# EAGLE schematic cap_touch_input (EAGLE 5.06)
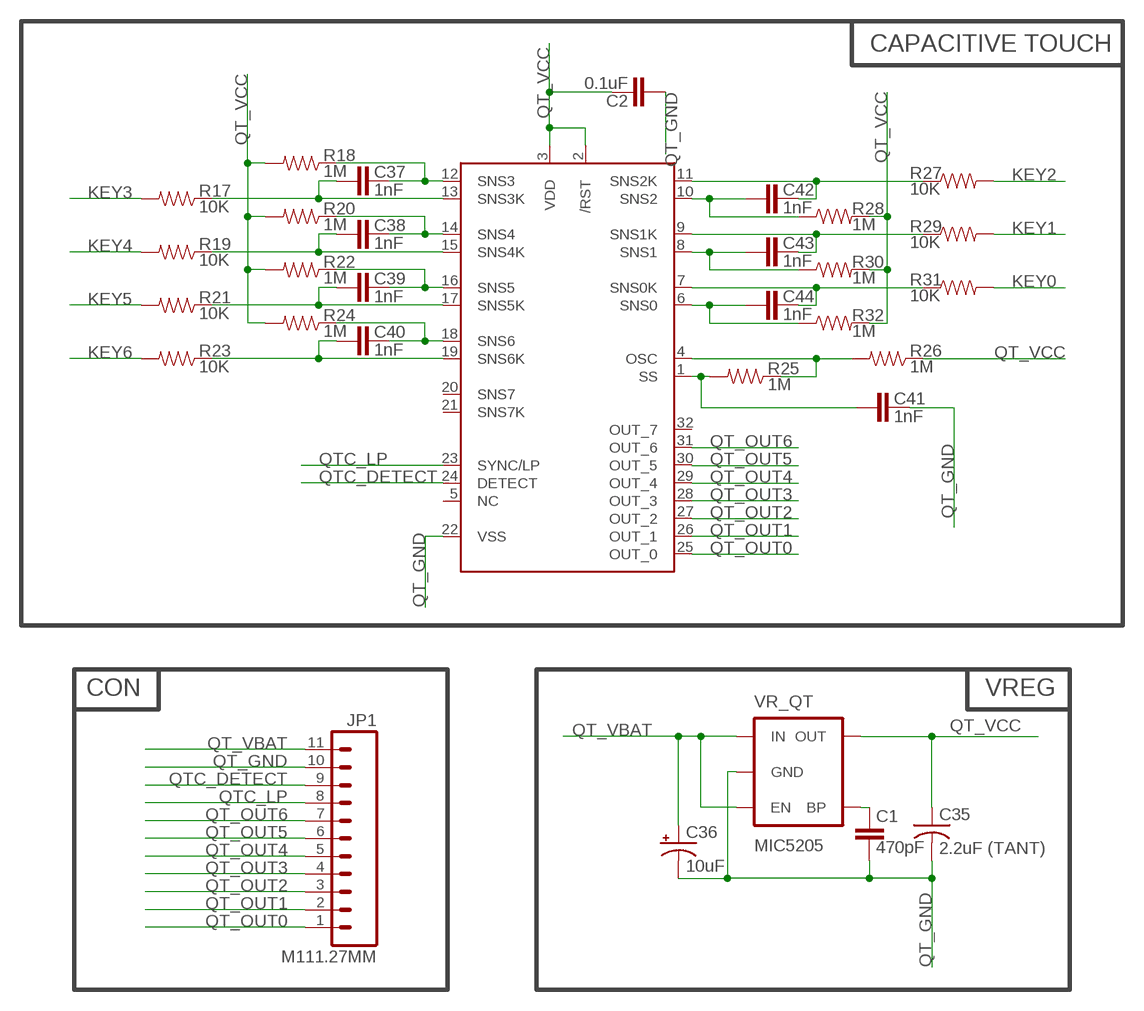
[diagram p0: schematic, sheet 1]

## Parts
C1  470pF  CAP0402  [C0402]
C2  0.1uF  CAP0402  [C0402]
C35  2.2uF (TANT)  C-USC0603K  [C0603K]
C36  10uF  CAP_POL1206  [EIA3216]
C37  1nF  CAP0402  [C0402]
C38  1nF  CAP0402  [C0402]
C39  1nF  CAP0402  [C0402]
C40  1nF  CAP0402  [C0402]
C41  1nF  CAP0402  [C0402]
C42  1nF  CAP0402  [C0402]
C43  1nF  CAP0402  [C0402]
C44  1nF  CAP0402  [C0402]
IC1  QT1081  [QFN-32]
JP1  M111.27MM  [1X11-1.27MM]
R17  10K  RESISTOR0402  [C0402]
R18  1M  RESISTOR0402  [C0402]
R19  10K  RESISTOR0402  [C0402]
R20  1M  RESISTOR0402  [C0402]
R21  10K  RESISTOR0402  [C0402]
R22  1M  RESISTOR0402  [C0402]
R23  10K  RESISTOR0402  [C0402]
R24  1M  RESISTOR0402  [C0402]
R25  1M  RESISTOR0402  [C0402]
R26  1M  RESISTOR0402  [C0402]
R27  10K  RESISTOR0402  [C0402]
R28  1M  RESISTOR0402  [C0402]
R29  10K  RESISTOR0402  [C0402]
R30  1M  RESISTOR0402  [C0402]
R31  10K  RESISTOR0402  [C0402]
R32  1M  RESISTOR0402  [C0402]
VR_QT  MIC5205  V_REG_LDOSMD  [SOT23-5]

## Nets
KEY0: R31.2
KEY1: R29.2
KEY2: R27.2
KEY3: R17.2
KEY4: R19.2
KEY5: R21.2
KEY6: R23.2
OSC: IC1.4(OSC) R25.1 R26.2
QT_GND: C1.1 C2.2 C35.2 C36.C(-) C41.1 IC1.22(VSS) JP1.10 VR_QT.2(GND)
QT_OUT0: IC1.25(OUT_0) JP1.1
QT_OUT1: IC1.26(OUT_1) JP1.2
QT_OUT2: IC1.27(OUT_2) JP1.3
QT_OUT3: IC1.28(OUT_3) JP1.4
QT_OUT4: IC1.29(OUT_4) JP1.5
QT_OUT5: IC1.30(OUT_5) JP1.6
QT_OUT6: IC1.31(OUT_6) JP1.7
QT_VBAT: C36.A(+) JP1.11 VR_QT.1(IN) VR_QT.3(EN)
QT_VCC: C2.1 C35.1 IC1.2(/RST) IC1.3(VDD) R18.2 R20.2 R22.2 R24.2 R26.1 R28.2 R30.2 R32.2 VR_QT.5(OUT)
QTC_DETECT: IC1.24(DETECT) JP1.9
QTC_LP: IC1.23(SYNC/LP) JP1.8
SNS0: C44.2 IC1.6(SNS0) R32.1
SNS0K: C44.1 IC1.7(SNS0K) R31.1
SNS1: C43.2 IC1.8(SNS1) R30.1
SNS1K: C43.1 IC1.9(SNS1K) R29.1
SNS2: C42.2 IC1.10(SNS2) R28.1
SNS2K: C42.1 IC1.11(SNS2K) R27.1
SNS3: C37.2 IC1.12(SNS3) R18.1
SNS3K: C37.1 IC1.13(SNS3K) R17.1
SNS4: C38.2 IC1.14(SNS4) R20.1
SNS4K: C38.1 IC1.15(SNS4K) R19.1
SNS5: C39.2 IC1.16(SNS5) R22.1
SNS5K: C39.1 IC1.17(SNS5K) R21.1
SNS6: C40.2 IC1.18(SNS6) R24.1
SNS6K: C40.1 IC1.19(SNS6K) R23.1
SS: C41.2 IC1.1(SS) R25.2
VRQT_BP: C1.2 VR_QT.4(BP)
Unconnected: IC1.5(NC) IC1.20(SNS7) IC1.21(SNS7K) IC1.32(OUT_7)

## Notes on the sheet
- CAPACITIVE TOUCH
- CON | VREG

## Library data of the parts
C1 C2 C37-C44 = SparkFun:CAP: Capacitor Standard 0603 ceramic capacitor, and 0.1" leaded capacitor.
C35 = rcl:C-US: CAPACITOR, American symbol
C36 = SparkFun-3-2-07:CAP_POL: Capacitor Polarized These are standard SMD and PTH capacitors. Normally 10uF, 47uF, and 100uF in electrolytic and tantalum varieties. Always verify the external diameter of the through hole cap, it varies with capacity, voltage, and manufacturer. The EIA devices should be standard.
IC1 = qtouch:QT1081: The QTouch QT1081 chip from Atmel - Formerly from Quantum Research Group - Pretty simple: You connect properly sized copper pads to the pins as shown in the datasheet, and you get eight logic level outputs. - Digikey: 427-1127-1-ND
JP1 = SparkFun:M11: Header 11 Standard 11-pin 0.1" header. Use with straight break away headers (SKU : PRT-00116), right angle break away headers (PRT-00553), swiss pins (PRT-00743), machine pins (PRT-00117), and female headers (PRT-00115).
R17-R32 = SparkFun:RESISTOR: Resistor Basic schematic elements and footprints for 0603, 1206, and PTH 1/10th watt (small) resistors.
VR_QT = SparkFun-3-2-07:V_REG_LDO: Voltage Regulator LDO Standard 150mA LDO voltage regulator in SOT-23 layout. Micrel part MIC5205. BP (by-pass) pin is used to lower output noise with 470pF cap.